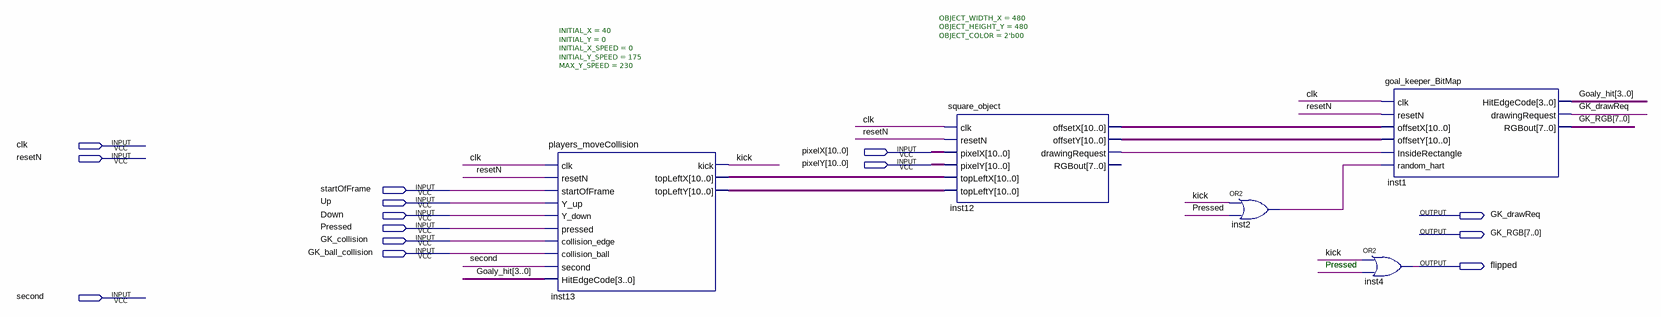
[diagram p0: schematic sheet]
// Quartus schematic GK_Block.bdf as structural Verilog: 5 symbols, 14 pins
module GK_Block (
  input  clk,
  input  [10:0] pixelX,
  input  resetN,
  input  [10:0] pixelY,
  input  startOfFrame,
  input  Up,
  input  Down,
  input  Pressed,
  input  GK_collision,
  input  GK_ball_collision,
  input  second,
  output GK_drawReq,
  output [7:0] GK_RGB,
  output flipped
);

  wire inst2_out, inst12_drawingrequest, kick;
  wire [3:0] Goaly_hit;
  wire [10:0] inst12_offsetx, inst12_offsety, inst13_topleftx, inst13_toplefty;

  players_moveCollision #(.INITIAL_X(40), .INITIAL_Y(0), .INITIAL_X_SPEED(0), .INITIAL_Y_SPEED(175), .MAX_Y_SPEED(230)) inst13 (
    .clk(clk), .resetN(resetN), .startOfFrame(startOfFrame), .Y_up(Up), .Y_down(Down), .pressed(Pressed),
    .collision_edge(GK_collision), .collision_ball(GK_ball_collision), .second(second),
    .HitEdgeCode(Goaly_hit), .kick(kick), .topLeftX(inst13_topleftx), .topLeftY(inst13_toplefty));
  square_object #(.OBJECT_WIDTH_X(480), .OBJECT_HEIGHT_Y(480), .OBJECT_COLOR(2'b00)) inst12 (
    .clk(clk), .resetN(resetN), .pixelX(pixelX), .pixelY(pixelY), .topLeftX(inst13_topleftx),
    .topLeftY(inst13_toplefty), .offsetX(inst12_offsetx), .offsetY(inst12_offsety),
    .drawingRequest(inst12_drawingrequest));  // open: RGBout
  or inst2 (inst2_out, kick, Pressed);
  goal_keeper_BitMap inst1 (
    .clk(clk), .resetN(resetN), .offsetX(inst12_offsetx), .offsetY(inst12_offsety),
    .InsideRectangle(inst12_drawingrequest), .random_hart(inst2_out), .HitEdgeCode(Goaly_hit),
    .drawingRequest(GK_drawReq), .RGBout(GK_RGB));
  or inst4 (flipped, kick, Pressed);

  // Notes on the sheet:
  //   Pressed
endmodule
